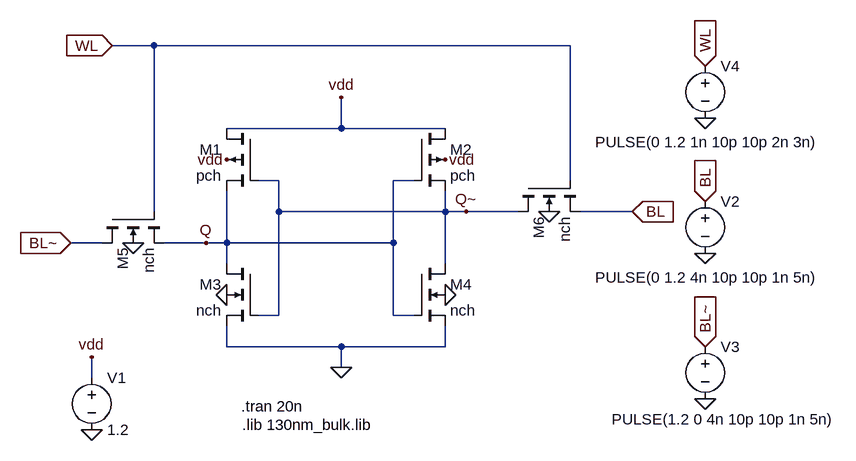
[diagram p0: schematic Simulation BitCell6T.asc]
Simulation BitCell6T.asc, the LTspice schematic file:
Version 4
SHEET 1 1040 680
WIRE -32 -80 -96 -80
WIRE 608 -80 -32 -80
WIRE 256 48 256 0
WIRE 256 48 80 48
WIRE 416 48 256 48
WIRE 160 128 128 128
WIRE 368 128 336 128
WIRE 608 128 608 -80
WIRE -32 176 -32 -80
WIRE 160 176 160 128
WIRE 416 176 416 144
WIRE 416 176 160 176
WIRE 448 176 416 176
WIRE 528 176 448 176
WIRE 704 176 624 176
WIRE -112 224 -160 224
WIRE 48 224 -16 224
WIRE 80 224 80 144
WIRE 80 224 48 224
WIRE 336 224 336 128
WIRE 336 224 80 224
WIRE 80 256 80 224
WIRE 416 256 416 176
WIRE 160 336 160 176
WIRE 160 336 128 336
WIRE 336 336 336 224
WIRE 368 336 336 336
WIRE 80 384 80 352
WIRE 256 384 80 384
WIRE 416 384 416 352
WIRE 416 384 256 384
WIRE 256 416 256 384
WIRE -128 432 -128 400
FLAG 416 96 vdd
FLAG 80 96 vdd
FLAG 256 0 vdd
FLAG 256 416 0
FLAG 576 176 0
FLAG -64 224 0
FLAG 80 304 0
FLAG 416 304 0
FLAG -96 -80 WL
IOPIN -96 -80 In
FLAG -160 224 BL~
IOPIN -160 224 In
FLAG 704 176 BL
IOPIN 704 176 In
FLAG -128 512 0
FLAG -128 400 vdd
FLAG 816 240 0
FLAG 816 464 0
FLAG 816 160 BL
IOPIN 816 160 In
FLAG 816 384 BL~
IOPIN 816 384 In
FLAG 816 32 0
FLAG 816 -48 WL
IOPIN 816 -48 In
FLAG 448 176 Q~
FLAG 48 224 Q
SYMBOL pmos4 128 48 M0
SYMATTR InstName M1
SYMATTR Value pch
SYMATTR Value2 l=130n w=260n
SYMBOL pmos4 368 48 R0
SYMATTR InstName M2
SYMATTR Value pch
SYMATTR Value2 l=130n w=260n
SYMBOL nmos4 128 256 M0
SYMATTR InstName M3
SYMATTR Value nch
SYMATTR Value2 l=130n w=260n
SYMBOL nmos4 368 256 R0
SYMATTR InstName M4
SYMATTR Value nch
SYMATTR Value2 l=130n w=260n
SYMBOL nmos4 -112 176 M90
SYMATTR InstName M5
SYMATTR Value nch
SYMATTR Value2 l=130n w=260n
SYMBOL nmos4 528 128 M90
SYMATTR InstName M6
SYMATTR Value nch
SYMATTR Value2 l=130n w=260n
SYMBOL voltage -128 416 R0
WINDOW 123 0 0 Left 0
WINDOW 39 0 0 Left 0
SYMATTR InstName V1
SYMATTR Value 1.2
SYMBOL voltage 816 144 R0
WINDOW 3 -169 133 Left 2
WINDOW 123 0 0 Left 0
WINDOW 39 0 0 Left 0
SYMATTR Value PULSE(0 1.2 4n 10p 10p 1n 5n)
SYMATTR InstName V2
SYMBOL voltage 816 368 R0
WINDOW 3 -144 128 Left 2
WINDOW 123 0 0 Left 0
WINDOW 39 0 0 Left 0
SYMATTR Value PULSE(1.2 0 4n 10p 10p 1n 5n)
SYMATTR InstName V3
SYMBOL voltage 816 -64 R0
WINDOW 3 -169 133 Left 2
WINDOW 123 0 0 Left 0
WINDOW 39 0 0 Left 0
SYMATTR Value PULSE(0 1.2 1n 10p 10p 2n 3n)
SYMATTR InstName V4
TEXT 104 504 Left 2 !.lib 130nm_bulk.lib
TEXT 102 476 Left 2 !.tran 20n

The netlist it stands for:
* Simulation BitCell6T.asc
M1 vdd Q~ Q vdd pch l=130n w=260n
M2 vdd Q Q~ vdd pch l=130n w=260n
M3 Q Q~ 0 0 nch l=130n w=260n
M4 Q~ Q 0 0 nch l=130n w=260n
M5 BL~ WL Q 0 nch l=130n w=260n
M6 Q~ WL BL 0 nch l=130n w=260n
V1 vdd 0 1.2
V2 BL 0 PULSE(0 1.2 4n 10p 10p 1n 5n)
V3 BL~ 0 PULSE(1.2 0 4n 10p 10p 1n 5n)
V4 WL 0 PULSE(0 1.2 1n 10p 10p 2n 3n)
.model NMOS NMOS
.model PMOS PMOS
.lib standard.mos
.lib 130nm_bulk.lib
.tran 20n
.backanno
.end

* Results of the author's LTspice run, read from the files saved beside the schematic
* Operating Point, zero values left out:
*   V(vdd) = 1.2 V
*   V(q~) = 1.2 V
*   V(q) = 13.05 µV
*   V(bl~) = 1.2 V
*   Id(M1) = 4.288 nA
*   Ib(M1) = 1.239 pA
*   Is(M1) = -4.289 nA
*   Id(M2) = 12.61 nA
*   Ig(M2) = -1.19 pA
*   Is(M2) = -12.61 nA
*   Id(M3) = 10.17 nA
*   Ig(M3) = 851.1 pA
*   Is(M3) = -11.02 nA
*   Id(M4) = 5.882 nA
*   Ig(M4) = -181.6 pA
*   Ib(M4) = -1.27 pA
*   Is(M4) = -5.699 nA
*   Id(M5) = 5.878 nA
*   Ig(M5) = -181.6 pA
*   Ib(M5) = -1.27 pA
*   Is(M5) = -5.695 nA
*   Id(M6) = 5.88 nA
*   Ig(M6) = -181.6 pA
*   Ib(M6) = -1.27 pA
*   Is(M6) = -5.697 nA
*   I(V1) = -16.9 nA
*   I(V2) = 5.697 nA
*   I(V3) = -5.878 nA
*   I(V4) = 363.2 pA
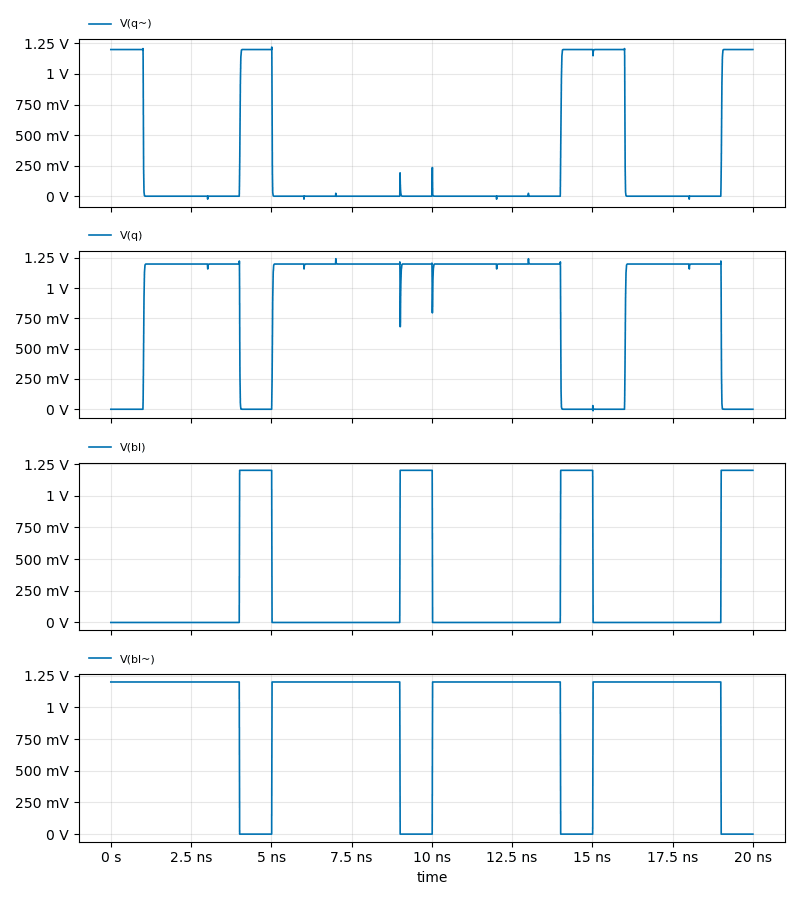
[diagram p1: Transient Analysis of Simulation BitCell6T.asc, plotted from the saved traces]
* Transient Analysis, 1 run:
*   V(q~): min -24.4 mV, max 1.22 V, average 299.1 mV, rms 596.7 mV, last 1.2 V
*   V(q): min -13.04 mV, max 1.244 V, average 897 mV, rms 1.036 V, last 3.157 µV
*   V(bl): min 0 V, max 1.2 V, average 241.5 mV, rms 537.6 mV, last 1.2 V
*   V(bl~): min 0 V, max 1.2 V, average 958.5 mV, rms 1.072 V, last 0 V